# EAGLE schematic LedClock (EAGLE 6.0)
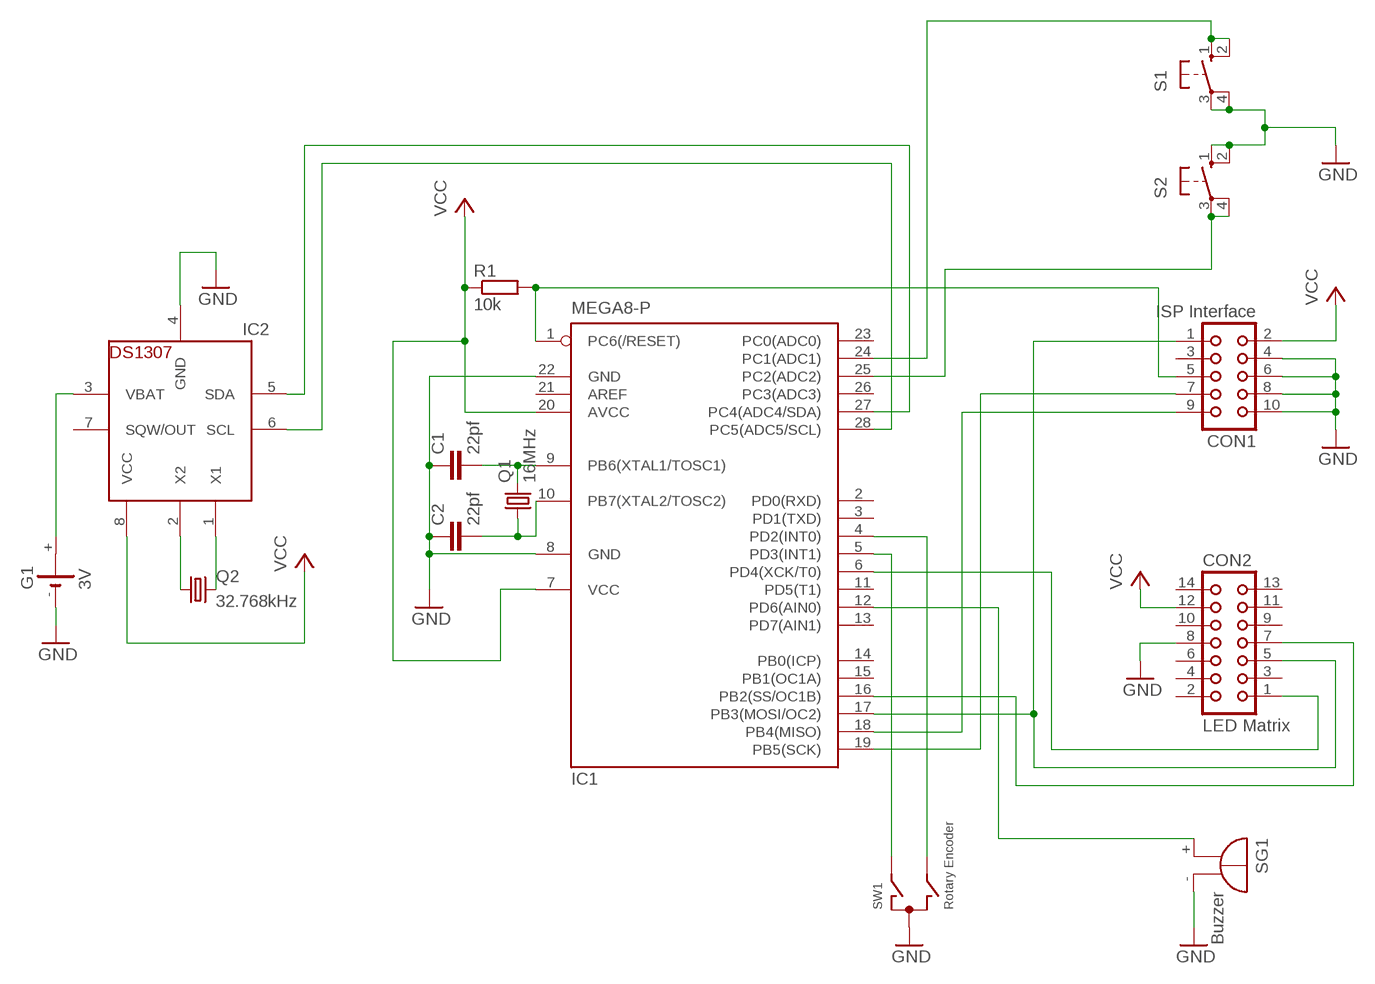
[diagram p0: schematic, sheet 1]

## Parts
C1  22pf  C-EU025-025X050  [C025-025X050]
C2  22pf  C-EU025-025X050  [C025-025X050]
CON1  ISP Interface  CON10  [CON10]
CON2  LED Matrix  CON14L  [CON14L]
G1  3V  CR2032H  [CR2032H]
IC1  MEGA8-P  [DIL28-3]
IC2  DS1307  [DIL08]
Q1  16MHz  CRYSTALHC49S  [HC49/S]
Q2  32.768kHz  CRYSTALTC38H  [TC38H]
R1  10k  R-EU_0207/10  [0207/10]
S1  10-XX  [B3F-10XX]
S2  10-XX  [B3F-10XX]
SG1  Buzzer  EB2209A  [EB2209A]
SW1  Rotary Encoder  EC12E_SW  [ALPS_EC12E_SW]

## Nets
GND: C1.1 C2.1 CON1.4 CON1.6 CON1.8 CON1.10 CON2.8 G1.- IC1.8(GND) IC1.22(GND) IC2.4(GND) S1.3(P) S1.4(P1) S2.1(S) S2.2(S1) SG1.- SW1.C
N$1: CON2.1 IC1.6(PD4(XCK/T0))
N$2: CON1.1 CON2.5 IC1.17(PB3(MOSI/OC2))
N$3: CON2.7 IC1.16(PB2(SS/OC1B))
N$4: IC1.12(PD6(AIN0)) SG1.+
N$5: CON1.5 IC1.1(PC6(/RESET)) R1.2
N$6: CON1.7 IC1.19(PB5(SCK))
N$7: CON1.9 IC1.18(PB4(MISO))
N$8: C2.2 IC1.10(PB7(XTAL2/TOSC2)) Q1.1
N$9: C1.2 IC1.9(PB6(XTAL1/TOSC1)) Q1.2
N$10: IC1.4(PD2(INT0)) SW1.B
N$11: G1.+ IC2.3(VBAT)
N$12: IC1.27(PC4(ADC4/SDA)) IC2.5(SDA)
N$13: IC2.2(X2) Q2.1
N$14: IC2.1(X1) Q2.2
N$15: IC1.28(PC5(ADC5/SCL)) IC2.6(SCL)
N$16: IC1.5(PD3(INT1)) SW1.A
N$17: IC1.24(PC1(ADC1)) S1.1(S) S1.2(S1)
N$18: IC1.25(PC2(ADC2)) S2.3(P) S2.4(P1)
VCC: CON1.2 CON2.12 IC1.7(VCC) IC1.20(AVCC) IC2.8(VCC) R1.1
Unconnected: CON1.3 CON2.2 CON2.3 CON2.4 CON2.6 CON2.9 CON2.10 CON2.11 CON2.13 CON2.14 G1.+@1(+) IC1.2(PD0(RXD)) IC1.3(PD1(TXD)) IC1.11(PD5(T1)) IC1.13(PD7(AIN1)) IC1.14(PB0(ICP)) IC1.15(PB1(OC1A)) IC1.21(AREF) IC1.23(PC0(ADC0)) IC1.26(PC3(ADC3)) IC2.7(SQW/OUT) SW1.D SW1.E SW1.GND1(G) SW1.GND2(G)

## Library data of the parts
C1 C2 = rcl:C-EU: CAPACITOR, European symbol
CON1 = con-harting:CON10: CONNECTOR; OC_FARNELL: unknown; OC_NEWARK: unknown
CON2 = con-harting:CON14L: CONNECTOR; OC_FARNELL: unknown; OC_NEWARK: unknown
G1 = battery:CR2032H: LI BATTERY Varta
IC1 = atmel:MEGA8-P: MICROCONTROLLER 8 Kbytes FLASH, 1 kbytes SRAM, 512 bytes EEPROM, USART, 4-channel 10 bit ADC, 2-channel 8 bit ADC Pin compatible with Atmega48, ATMega88, ATMega168 Source: avr.lbr; OC_FARNELL: unknown; OC_NEWARK: unknown
IC2 = adafruit:DS1307: DS1307 Real time clock (RTC) with battery backup ability. Talk to it via i2c
Q1 = crystal:CRYSTAL: CRYSTAL; OC_FARNELL: 1667008; OC_NEWARK: unknown
Q2 = crystal:CRYSTAL: CRYSTAL; OC_FARNELL: unknown; OC_NEWARK: unknown
R1 = rcl:R-EU_: RESISTOR, European symbol
S1 S2 = switch-omron:10-XX: OMRON SWITCH; MPN: B3F-1000; OC_FARNELL: 176432; OC_NEWARK: 36M3542
SG1 = buzzer:EB2209A: BUZZER Source: Buerklin; OC_FARNELL: unknown; OC_NEWARK: unknown
SW1 = switch-alps:EC12E_SW: ALPS rotary Encoder EC12E series with switch; MPN: EC12E2424407; OC_FARNELL: 1520813; OC_NEWARK: 74M1068